# Altium project Node_Water.PrjPcb
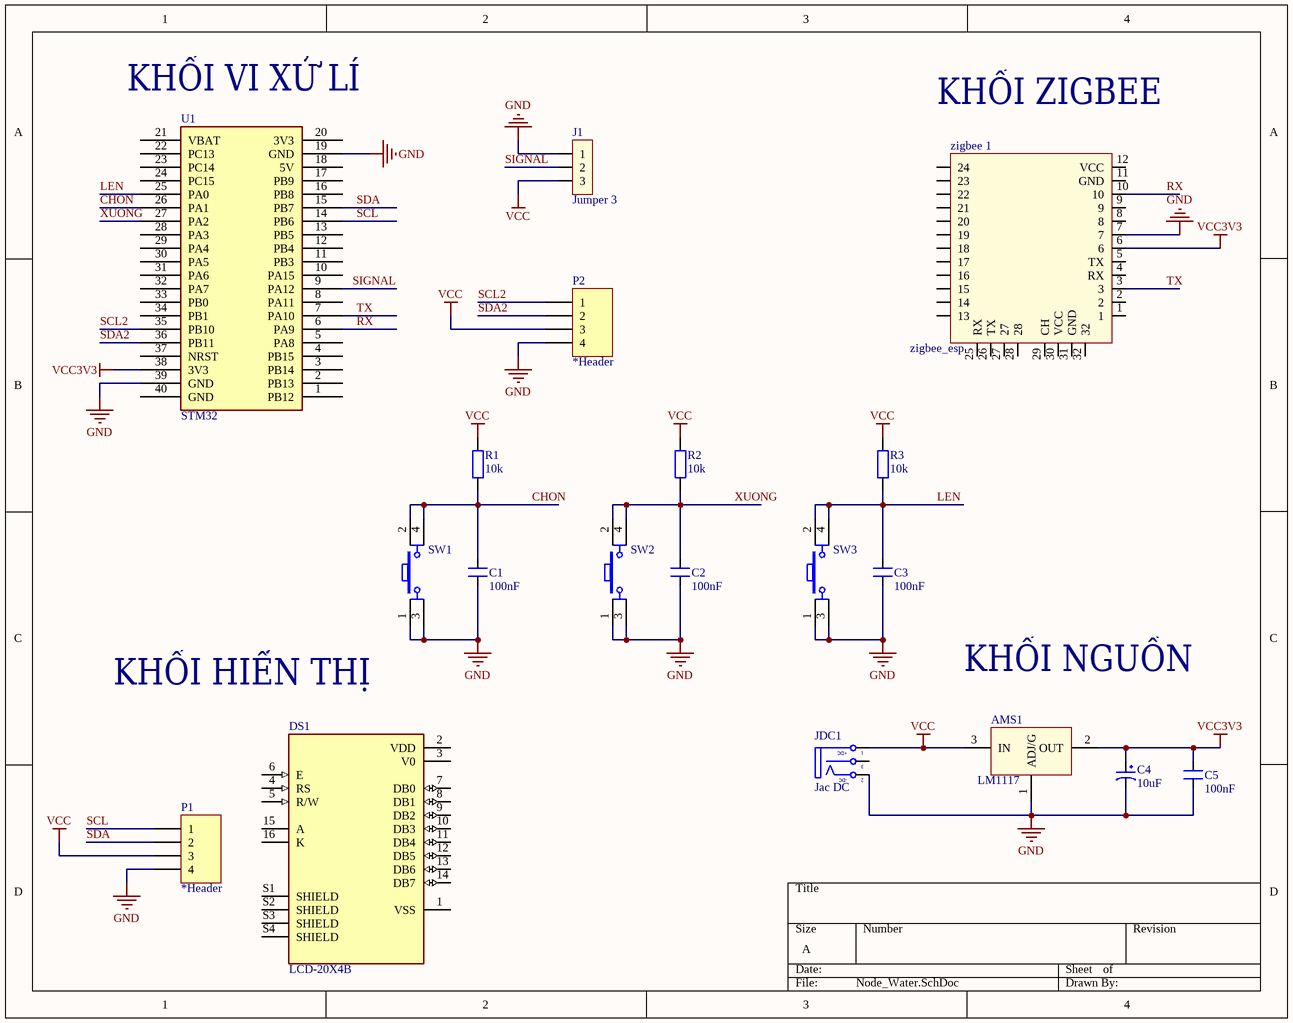
[diagram p0: Node_Water.SchDoc]
1 sheet, 19 parts. Net scope: global (net labels, ports and power ports of the same name join across sheets).
Board file: Node_Water.PcbDoc

## Sheet Node_Water.SchDoc
size A; SheetNumber: 1; SheetTotal: 1

### Parts
AMS1  LM1117  [SOT223-4N]
C1  100nF  [CN1]
C2  100nF  [CN1]
C3  100nF  [CN1]
C4  10uF  [CP1/2]
C5  100nF  [CN1]
DS1  LCD-20X4B  [LCD_LCD-20X4B]
J1  Jumper 3  [JP3]
JDC1  Jac DC  [DC-IN]
P1  *Header  [HDR1X4]
P2  *Header  [HDR1X4]
R1  10k  [R1/4W]
R2  10k  [R1/4W]
R3  10k  [R1/4W]
SW1  SW  [SW4]  (value not drawn)
SW2  SW  [SW4]  (value not drawn)
SW3  SW  [SW4]  (value not drawn)
U1  STM32  [STM32]
zigbee_1  zigbee_esp  [zigbee]

### Nets
GND: AMS1.1(ADJ/G) C1.1 C2.1 C3.1 C4.2 C5.1 J1.1 JDC1.2(TN) P1.4 P2.4 SW1.1 SW1.3 SW2.1 SW2.3 SW3.1 SW3.3 U1.19(GND) U1.39(GND) zigbee_1.7
VCC: AMS1.3(IN) J1.3 JDC1.1(T) P1.3 P2.3 R1.2 R2.2 R3.2
VCC3V3: AMS1.2(OUT) C4.1 C5.2 U1.38(3V3) zigbee_1.6
CHON: C1.2 R1.1 SW1.2 SW1.4 U1.26(PA1)
LEN: C3.2 R3.1 SW3.2 SW3.4 U1.25(PA0)
RX: U1.6(PA9) zigbee_1.10
SCL: P1.1 U1.14(PB6)
SCL2: P2.1 U1.35(PB10)
SDA: P1.2 U1.15(PB7)
SDA2: P2.2 U1.36(PB11)
SIGNAL: J1.2 U1.9(PA12)
TX: U1.7(PA10) zigbee_1.3
XUONG: C2.2 R2.1 SW2.2 SW2.4 U1.27(PA2)

Not connected (* = marked no-connect by the designer): DS1 1(VSS) 2(VDD) 3(V0) 4(RS) 5(R/W) 6(E) 7(DB0) 8(DB1) 9(DB2) 10(DB3) 11(DB4) 12(DB5) 13(DB6) 14(DB7) 15(A) 16(K) S1(SHIELD) S2(SHIELD) S3(SHIELD) S4(SHIELD); JDC1 3(S); U1 1(PB12) 2(PB13) 3(PB14) 4(PB15) 5(PA8) 8(PA11) 10(PA15) 11(PB3) 12(PB4) 13(PB5) 16(PB8) 17(PB9) 18(5V) 20(3V3) 21(VBAT) 22(PC13) 23(PC14) 24(PC15) 28(PA3) 29(PA4) 30(PA5) 31(PA6) 32(PA7) 33(PB0) 34(PB1) 37(NRST) 40(GND); zigbee_1 1 2 4(RX) 5(TX) 8 9 11(GND) 12(VCC) 13 14 15 16 17 18 19 20 21 22 23 24 25(RX) 26(TX) 27 28 29(CH) 30(VCC) 31(GND) 32

### Notes on the sheet
- (near U1) KHỐI VI XỬ LÍ
- KHỐI ZIGBEE
- KHỐI HIỂN THỊ
- KHỐI NGUỒN
- (in symbol DCIN) +DC; -DC

### Library data of the parts
AMS1 = LM1117: Available in 1.8V, 2.5V, 2.85V, 3.3V, 5V, and  Adjustable Versions; Value: LM317
C1-C3 C5 = CN0: Cremic For Xtal 1pF => 100pF; Value: 33pF
C4 = CP1: Cap P  0,1uF < 22uF , 16 - 50V; Value: 10uF/50V; Description 1: 10 => 220uF/6,3V/10V - 10uF => 100uF/16V; Description 2: 0,1uF => 33uF/50V - 10uF => 22uF/63V; Description 3: 0,47uF => 10uF/100V
DS1 = LCD-20X4B: Display Development Tools 20X4 CHARACTER BLUE LCD W/BACKLIGHT; MF: Gravitech; MP: LCD-20X4B; Purchase-URL: https://pricing.snapeda.com/search/part/LCD-20X4B/?ref=eda; Value: *; SnapEDA_Link: https://www.snapeda.com/parts/LCD-20X4B/Gravitech/view-part/?ref=snap; Price: None; Package: None; Check_prices: https://www.snapeda.com/parts/LCD-20X4B/Gravitech/view-part/?ref=eda; Availability: In Stock
J1 = JP3: Value: J3
JDC1 = DCIN: Jac DC input; Value: Jac DC
P1 P2 = Header 4: Header, 4-Pin, Right Angle; LatestRevisionDate: 17-Jul-2002; LatestRevisionNote: Re-released for DXP Platform.; Publisher: Altium Limited
R1-R3 = R1/4W: Resistor 1/4W; Value: R1/4W - 1K
SW1-SW3 = SW4: Switch button 4 pin; Value: Button chip 4 pin